# Altium project Design.PrjPcb
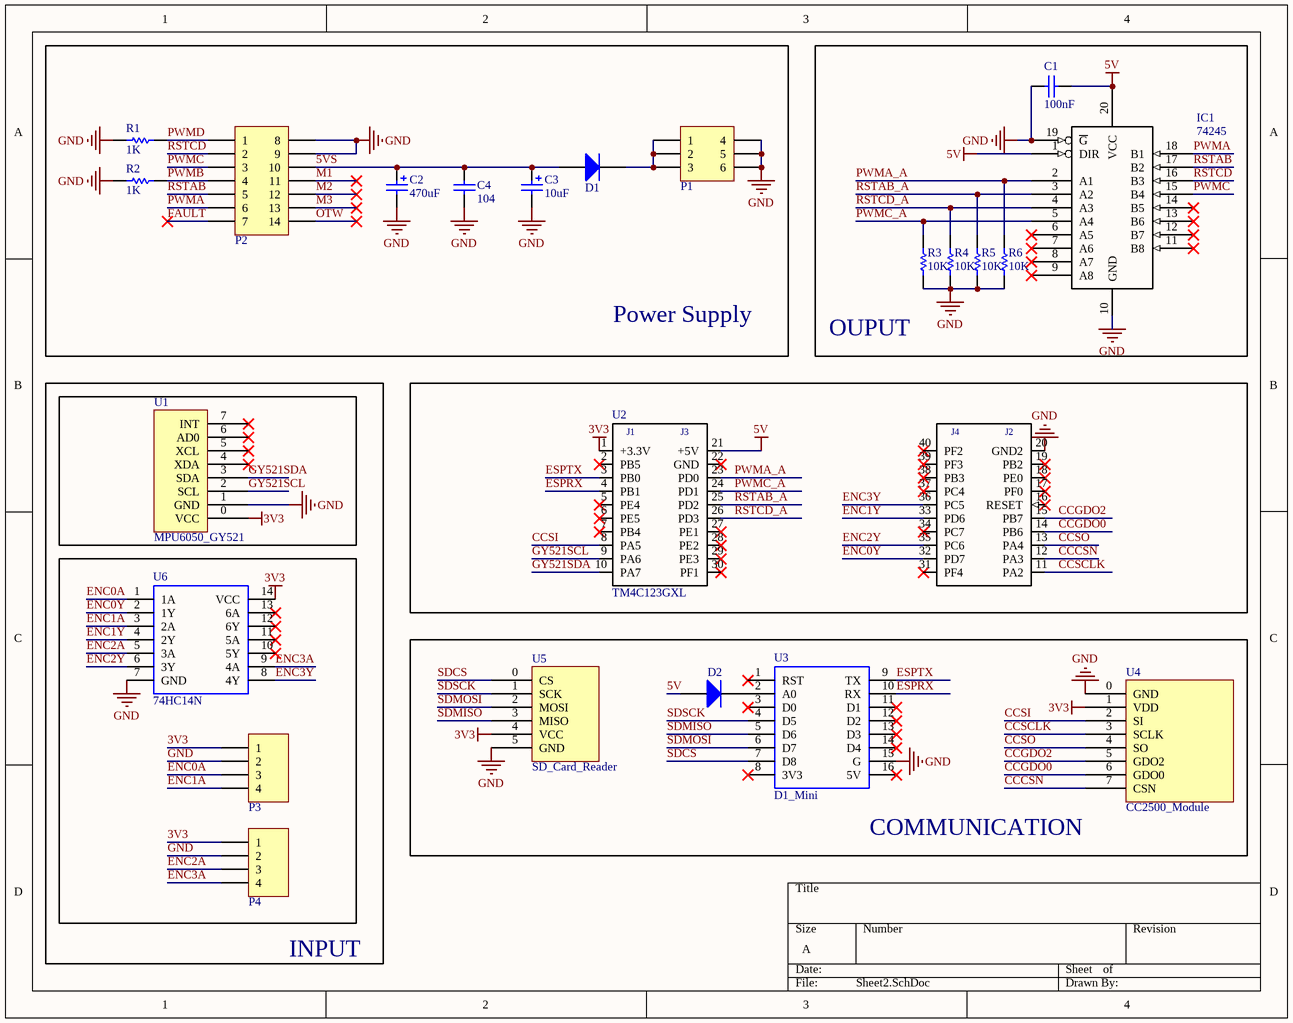
[diagram p0: Sheet2.SchDoc]
1 sheet, 23 parts. Net scope: global (net labels, ports and power ports of the same name join across sheets).
Board file: PCB1.PcbDoc

## Sheet Sheet2.SchDoc
size A

### Parts
C1  value 100nF  [CN1]  (hidden comment: Cap Non-Pol)
C2  value 470uF  [CP1/2]  (hidden comment: Cap Pol)
C3  value 10uF  [CP1/2]  (hidden comment: Cap Pol)
C4  value 104  [CN1]  (hidden comment: Cap Non-Pol)
D1  Diode  [D1A]  (value not drawn)
D2  Diode  [D1A]  (value not drawn)
IC1  74245  [DIP20]
P1  Header 3X2  [JP3x2]  (value not drawn)
P2  Header 7X2  [JP7X2]  (value not drawn)
P3  Header 4H  [JP4H]  (value not drawn)
P4  Header 4H  [JP4H]  (value not drawn)
R1  value 1K  [RES 1/2W]  (hidden comment: RESISTOR)
R2  value 1K  [RES 1/2W]  (hidden comment: RESISTOR)
R3  value 10K  [RES 1/2W]  (hidden comment: RESISTOR)
R4  value 10K  [RES 1/2W]  (hidden comment: RESISTOR)
R5  value 10K  [RES 1/2W]  (hidden comment: RESISTOR)
R6  value 10K  [RES 1/2W]  (hidden comment: RESISTOR)
U1  MPU6050_GY521  [MPU6050_GY521]
U2  TM4C123GXL  [EK-TM4C123GXL]
U3  D1_Mini  [D1_Mini]
U4  CC2500_Module  [CC2500_module]
U5  SD_Card_Reader  [SD_Card_Reader]
U6  74HC14N  [74HC14N]

### Blocks framed on the sheet
Power Supply: C2-C4 D1 P1 P2 R1 R2
OUPUT: C1 IC1 R3-R6
INPUT: P3 P4 U1 U6
COMMUNICATION: D2 U3-U5

### Nets
3V3: P3.1 P4.1 U1.0(VCC) U2.1(+3.3V) U4.1(VDD) U5.4(VCC) U6.14(VCC)
5V: C1.2 D2.1(A) IC1.1(DIR) IC1.20(VCC) U2.21(+5V)
GND: C1.1 C2.2 C3.2 C4.2 IC1.10(GND) IC1.19(~{G}) P1.4 P1.5 P1.6 P2.8 P2.9 P3.2 P4.2 R1.1 R2.1 R3.1 R4.1 R5.1 R6.1 U1.1(GND) U2.20(GND2) U3.15(G) U4.0(GND) U5.5(GND) U6.7(GND)
5VS: C2.1 C3.1 C4.1 D1.1(A) P2.10
CCCSN: U2.12(PA3) U4.7(CSN)
CCGDO0: U2.14(PB6) U4.6(GDO0)
CCGDO2: U2.15(PB7) U4.5(GDO2)
CCSCLK: U2.11(PA2) U4.3(SCLK)
CCSI: U2.8(PA5) U4.2(SI)
CCSO: U2.13(PA4) U4.4(SO)
ENC0A: P3.3 U6.1(1A)
ENC0Y: U2.32(PD7) U6.2(1Y)
ENC1A: P3.4 U6.3(2A)
ENC1Y: U2.33(PD6) U6.4(2Y)
ENC2A: P4.3 U6.5(3A)
ENC2Y: U2.35(PC6) U6.6(3Y)
ENC3A: P4.4 U6.9(4A)
ENC3Y: U2.36(PC5) U6.8(4Y)
ESPRX: U2.4(PB1) U3.10(RX)
ESPTX: U2.3(PB0) U3.9(TX)
FAULT: P2.7
GY521SCL: U1.2(SCL) U2.9(PA6)
GY521SDA: U1.3(SDA) U2.10(PA7)
M1: P2.11
M2: P2.12
M3: P2.13
OTW: P2.14
PWMA: IC1.18(B1) P2.6
PWMA_A: IC1.2(A1) R6.2 U2.23(PD0)
PWMB: P2.4 R2.2
PWMC: IC1.15(B4) P2.3
PWMC_A: IC1.5(A4) R3.2 U2.24(PD1)
PWMD: P2.1 R1.2
RSTAB: IC1.17(B2) P2.5
RSTAB_A: IC1.3(A2) R5.2 U2.25(PD2)
RSTCD: IC1.16(B3) P2.2
RSTCD_A: IC1.4(A3) R4.2 U2.26(PD3)
SDCS: U3.7(D8) U5.0(CS)
SDMISO: U3.5(D6) U5.3(MISO)
SDMOSI: U3.6(D7) U5.2(MOSI)
SDSCK: U3.4(D5) U5.1(SCK)
NetD1_2: D1.2(K) P1.1 P1.2 P1.3
NetD2_2: D2.2(K) U3.2(A0)

Not connected (* = marked no-connect by the designer): IC1 6(A5)* 7(A6)* 8(A7)* 9(A8)* 11(B8)* 12(B7)* 13(B6)* 14(B5)*; U1 4(XDA)* 5(XCL)* 6(AD0)* 7(INT)*; U2 2(PB5)* 5(PE4)* 6(PE5)* 7(PB4)* 16(RESET)* 17(PF0)* 18(PE0)* 19(PB2)* 22(GND)* 27(PE1)* 28(PE2)* 29(PE3)* 30(PF1)* 31(PF4)* 34(PC7)* 37(PC4)* 38(PB3)* 39(PF3)* 40(PF2)*; U3 1(RST)* 3(D0)* 8(3V3)* 11(D1)* 12(D2)* 13(D3)* 14(D4)* 16(5V)*; U6 10(5Y)* 11(5A)* 12(6Y)* 13(6A)*

### Notes on the sheet
- (in symbol EK-TM4C123GXL) J1; J3; J4; J2

### Library data of the parts
C1 C4 = Cap Non-Pol: Capacitor
C2 C3 = Cap Pol: Polarized Capacitor (Radial)
D1 D2 = Diode: Default Diode
IC1 = 74245_1: Octal bus tranceiver; 3-state; Copyright by: VanDungEvn@gmail.com
P1 = Header 3X2: Header, 3-Pin, Dual row; LatestRevisionDate: 17-Jul-2002; LatestRevisionNote: Re-released for DXP Platform.; Publisher: Altium Limited
P2 = Header 7X2: Header, 7-Pin, Dual row; LatestRevisionDate: 17-Jul-2002; LatestRevisionNote: Re-released for DXP Platform.; Publisher: Altium Limited
P3 P4 = Header 4H: Header, 4-Pin, Right Angle; LatestRevisionDate: 17-Jul-2002; LatestRevisionNote: Re-released for DXP Platform.; Publisher: Altium Limited
U2 = EK-TM4C123GXL